# Altium project LOGI-BONE.PrjPcb (part 2 of 2)

## Sheet PERIPHERAL_PORT_IO.SchDoc: Peripheral Port IO
size B; Engineer: M. Jones; Organization: Michael Jones; DocumentNumber: 5; Revision: RA.1; SheetNumber: 5; SheetTotal: 7
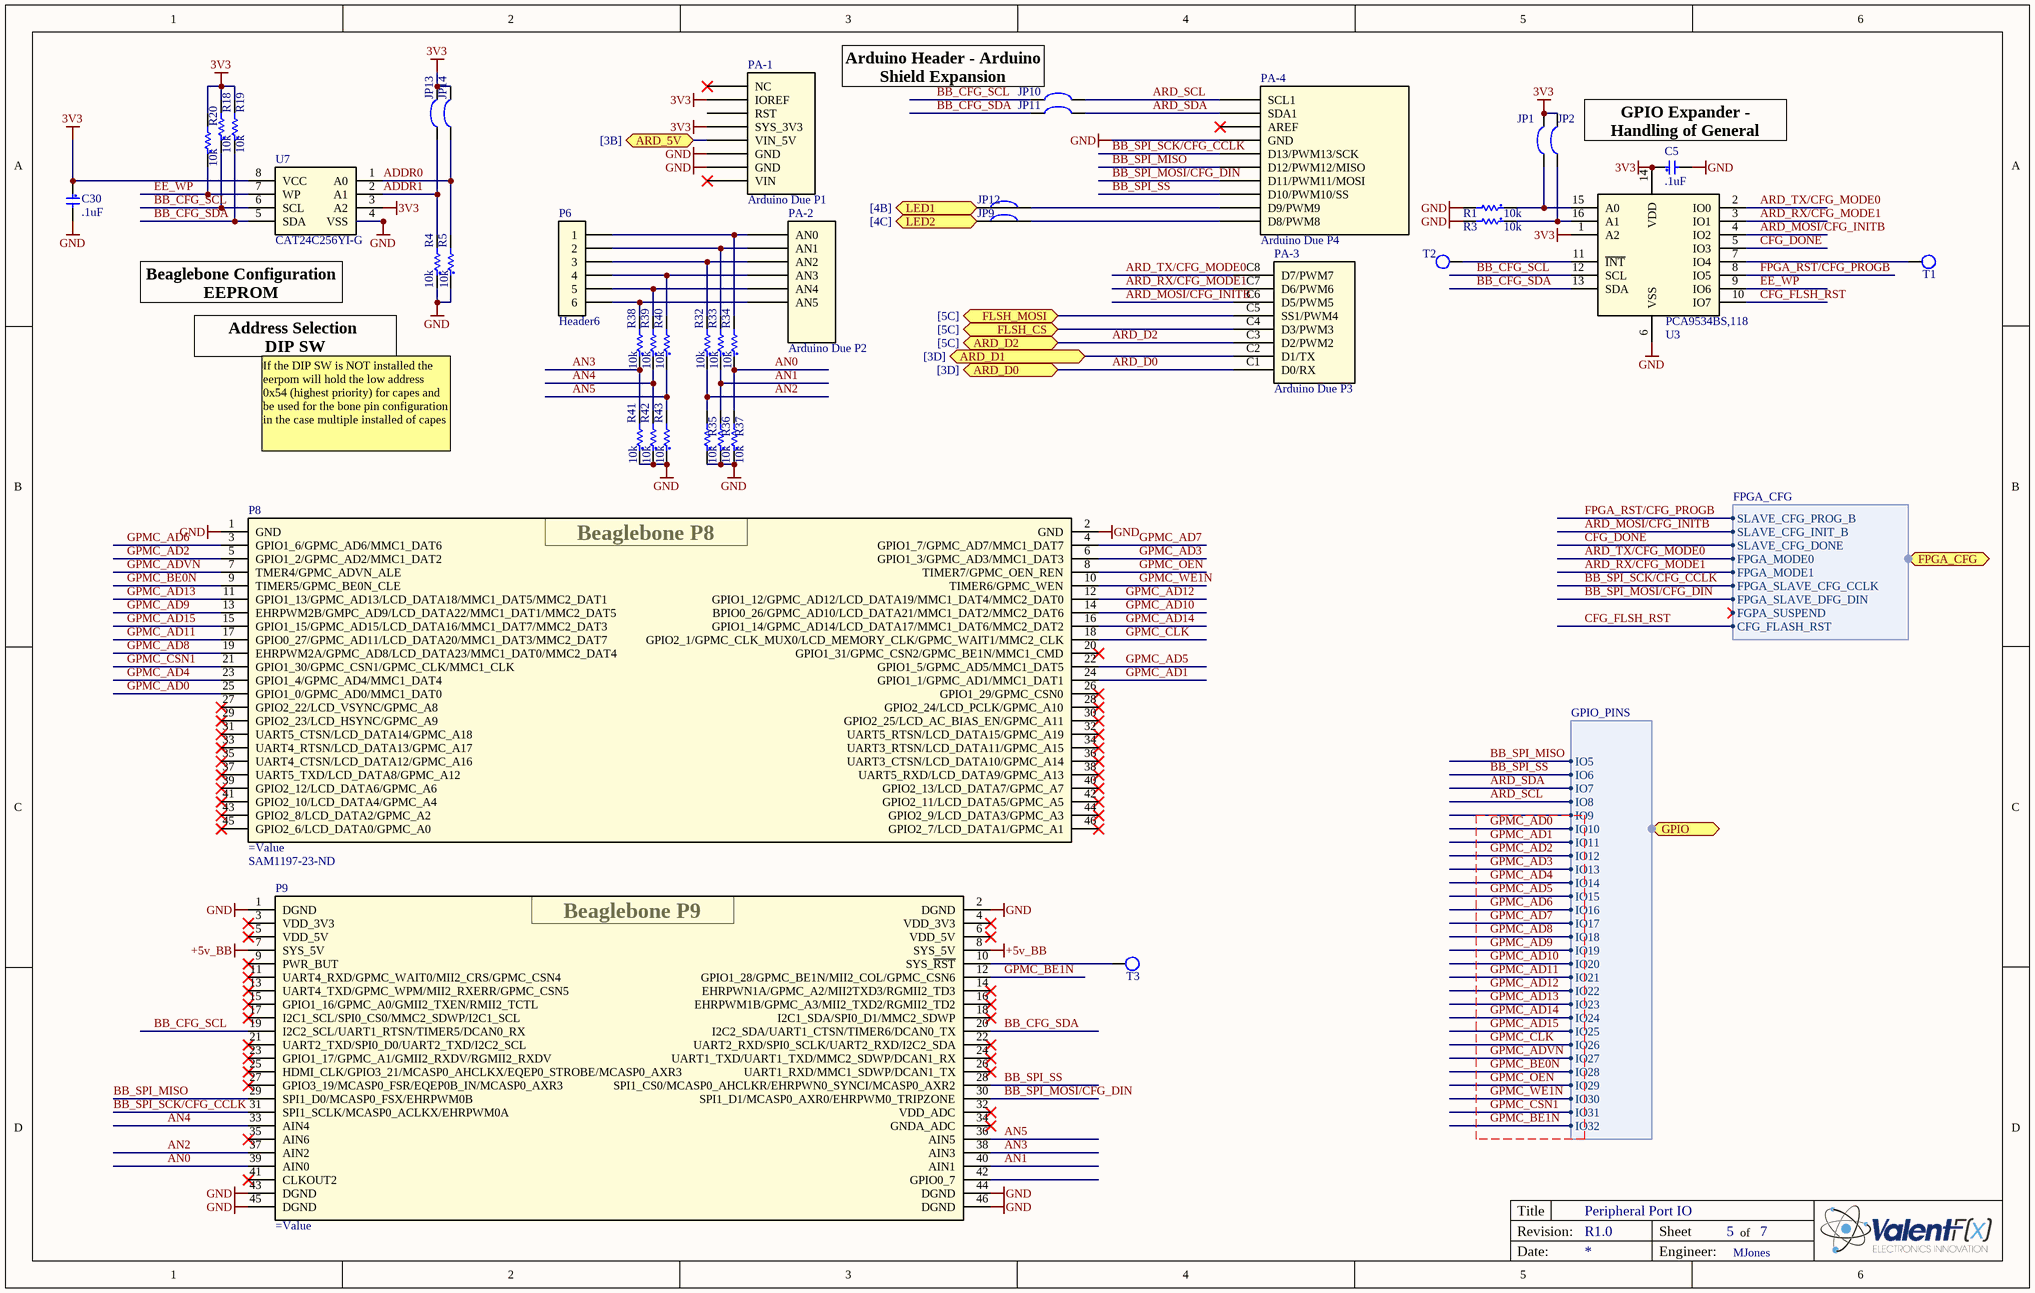
[diagram p4: PERIPHERAL_PORT_IO.SchDoc]

### Parts
C5  .1uF  [c0603]
C30  .1uF  [c0603]
JP1  Solder Jumper  [SOLDER_JUMPER]  (value not drawn)  (net tie, no BOM)
JP2  Solder Jumper  [SOLDER_JUMPER]  (value not drawn)  (net tie, no BOM)
JP9  Solder Jumper-NC  [SOLDER_JUMPER-NC]  (value not drawn)  (net tie, no BOM)
JP10  Solder Jumper  [SOLDER_JUMPER]  (value not drawn)  (net tie, no BOM)
JP11  Solder Jumper  [SOLDER_JUMPER]  (value not drawn)  (net tie, no BOM)
JP12  Solder Jumper-NC  [SOLDER_JUMPER-NC]  (value not drawn)  (net tie, no BOM)
JP13  Solder Jumper  [SOLDER_JUMPER]  (value not drawn)  (net tie, no BOM)
JP14  Solder Jumper  [SOLDER_JUMPER]  (value not drawn)  (net tie, no BOM)
P6  Header6  [HEADER_6_40_100 THRU SIP]  (no BOM)
P8  Supplier Part Number 1: SAM1197-23-ND  [Beaglebone-SSQ]
P9  (no value)  [Beaglebone-SSQ]
PA-1  Arduino Due P1  [Arduino Due P1]
PA-2  Arduino Due P2  [Arduino Due P2]
PA-3  Arduino Due P3  [Arduino Due P3]
PA-4  Arduino Due P4  [Arduino Due P4]
R1  10k  [R0603]
R3  10k  [R0603]
R4  10k  [R0603]
R5  10k  [R0603]
R18  10k  [R0603]
R19  10k  [R0603]
R20  10k  [R0603]
R32  10k  [R0603]
R33  10k  [R0603]
R34  10k  [R0603]
R35  10k  [R0603]
R36  10k  [R0603]
R37  10k  [R0603]
R38  10k  [R0603]
R39  10k  [R0603]
R40  10k  [R0603]
R41  10k  [R0603]
R42  10k  [R0603]
R43  10k  [R0603]
T1  Test Point  [Tp 25-40]  (value not drawn)  (no BOM)
T2  Test Point  [Tp 25-40]  (value not drawn)  (no BOM)
T3  Test Point  [Tp 25-40]  (value not drawn)  (no BOM)
U3  PCA9534BS,118  [EXP - PCA9534BS,118 - QFN65P400X400X100-16M]
U7  CAT24C256YI-G  [TSSOP 8]

### Ports
ARD_5V (see [3B]), ARD_D0 (see [3D]), ARD_D1 (see [3D]), ARD_D2 (see [5C]), FLSH_CS (see [5C]), FLSH_MOSI (see [5C]), FPGA_CFG (harness FPGA_CFG, see [1D]), GPIO (harness GPIO_PINS, see [1A]), LED1 (see [4B]), LED2 (see [4C])

### Harnesses
FPGA_CFG: SLAVE_CFG_PROG_B, SLAVE_CFG_INIT_B, SLAVE_CFG_DONE, FPGA_MODE0, FPGA_MODE1, FPGA_SLAVE_CFG_CCLK, FPGA_SLAVE_DFG_DIN, FGPA_SUSPEND, CFG_FLASH_RST
GPIO_PINS: IO5, IO6, IO7, IO8, IO9, IO10, IO11, IO12, IO13, IO14, IO15, IO16, IO17, IO18, IO19, IO20, IO21, IO22, IO23, IO24, IO25, IO26, IO27, IO28, IO29, IO30, IO31, IO32

### Nets
3V3: C5.1 C30.1 JP1.2 JP2.2 JP13.2 JP14.2 PA-1.A2(IOREF) PA-1.A4(SYS_3V3) R18.2 R19.2 R20.2 U3.1(A2) U3.14(VDD) U7.3(A2) U7.8(VCC)
+5v_BB: P9.7(SYS_5V) P9.8(SYS_5V)
GND: C5.2 C30.2 P8.1(GND) P8.2(GND) P9.1(DGND) P9.2(DGND) P9.43(DGND) P9.44(DGND) P9.45(DGND) P9.46(DGND) PA-1.A6(GND) PA-1.A7(GND) PA-4.D7(GND) R1.2 R3.2 R4.1 R5.1 R35.1 R36.1 R37.1 R41.1 R42.1 R43.1 U3.6(VSS) U7.4(VSS)
ADDR0: JP14.1 R5.2 U7.1(A0)
ADDR1: JP13.1 R4.2 U7.2(A1)
AN0: P9.39(AIN0) R34.1 R37.2
AN1: P9.40(AIN1) R33.1 R36.2
AN2: P9.37(AIN2) R32.1 R35.2
AN3: P9.38(AIN3) R38.1 R41.2
AN4: P9.33(AIN4) R39.1 R42.2
AN5: P9.36(AIN5) R40.1 R43.2
ARD_D0: PA-3.C1(D0/RX) ; port ARD_D0
ARD_D2: PA-3.C3(D2/PWM2) ; port ARD_D2
ARD_MOSI/CFG_INITB: PA-3.C6(D5/PWM5) U3.4(IO2) ; port FPGA_CFG.SLAVE_CFG_INIT_B
ARD_RX/CFG_MODE1: PA-3.C7(D6/PWM6) U3.3(IO1) ; port FPGA_CFG.FPGA_MODE1
ARD_SCL: JP10.2 PA-4.D10(SCL1) ; port GPIO.IO8
ARD_SDA: JP11.2 PA-4.D9(SDA1) ; port GPIO.IO7
ARD_TX/CFG_MODE0: PA-3.C8(D7/PWM7) U3.2(IO0) ; port FPGA_CFG.FPGA_MODE0
BB_CFG_SCL: JP10.1 P9.19(I2C2_SCL/UART1_RTSN/TIMER5/DCAN0_RX) R18.1 U3.12(SCL) U7.6(SCL)
BB_CFG_SDA: JP11.1 P9.20(I2C2_SDA/UART1_CTSN/TIMER6/DCAN0_TX) R19.1 U3.13(SDA) U7.5(SDA)
BB_SPI_MISO: P9.29(SPI1_D0/MCASP0_FSX/EHRPWM0B) PA-4.D5(D12/PWM12/MISO) ; port GPIO.IO5
BB_SPI_MOSI/CFG_DIN: P9.30(SPI1_D1/MCASP0_AXR0/EHRPWM0_TRIPZONE) PA-4.D4(D11/PWM11/MOSI) ; port FPGA_CFG.FPGA_SLAVE_DFG_DIN
BB_SPI_SCK/CFG_CCLK: P9.31(SPI1_SCLK/MCASP0_ACLKX/EHRPWM0A) PA-4.D6(D13/PWM13/SCK) ; port FPGA_CFG.FPGA_SLAVE_CFG_CCLK
BB_SPI_SS: P9.28(SPI1_CS0/MCASP0_AHCLKR/EHRPWN0_SYNCI/MCASP0_AXR2) PA-4.D3(D10/PWM10/SS) ; port GPIO.IO6
CFG_DONE: U3.5(IO3) ; port FPGA_CFG.SLAVE_CFG_DONE
CFG_FLSH_RST: U3.10(IO7) ; port FPGA_CFG.CFG_FLASH_RST
EE_WP: R20.1 U3.9(IO6) U7.7(WP)
FLSH_CS_ARD: PA-3.C4(D3/PWM3) ; port FLSH_CS
FLSH_MOSI_ARD: PA-3.C5(SS1/PWM4) ; port FLSH_MOSI
FPGA_RST/CFG_PROGB: U3.8(IO5) ; port FPGA_CFG.SLAVE_CFG_PROG_B
GPMC_AD0: P8.25(GPIO1_0/GPMC_AD0/MMC1_DAT0) ; port GPIO.IO10
GPMC_AD1: P8.24(GPIO1_1/GPMC_AD1/MMC1_DAT1) ; port GPIO.IO11
GPMC_AD2: P8.5(GPIO1_2/GPMC_AD2/MMC1_DAT2) ; port GPIO.IO12
GPMC_AD3: P8.6(GPIO1_3/GPMC_AD3/MMC1_DAT3) ; port GPIO.IO13
GPMC_AD4: P8.23(GPIO1_4/GPMC_AD4/MMC1_DAT4) ; port GPIO.IO14
GPMC_AD5: P8.22(GPIO1_5/GPMC_AD5/MMC1_DAT5) ; port GPIO.IO15
GPMC_AD6: P8.3(GPIO1_6/GPMC_AD6/MMC1_DAT6) ; port GPIO.IO16
GPMC_AD7: P8.4(GPIO1_7/GPMC_AD7/MMC1_DAT7) ; port GPIO.IO17
GPMC_AD8: P8.19(EHRPWM2A/GPMC_AD8/LCD_DATA23/MMC1_DAT0/MMC2_DAT4) ; port GPIO.IO18
GPMC_AD9: P8.13(EHRPWM2B/GMPC_AD9/LCD_DATA22/MMC1_DAT1/MMC2_DAT5) ; port GPIO.IO19
GPMC_AD10: P8.14(BPIO0_26/GPMC_AD10/LCD_DATA21/MMC1_DAT2/MMC2_DAT6) ; port GPIO.IO20
GPMC_AD11: P8.17(GPIO0_27/GPMC_AD11/LCD_DATA20/MMC1_DAT3/MMC2_DAT7) ; port GPIO.IO21
GPMC_AD12: P8.12(GPIO1_12/GPMC_AD12/LCD_DATA19/MMC1_DAT4/MMC2_DAT0) ; port GPIO.IO22
GPMC_AD13: P8.11(GPIO1_13/GPMC_AD13/LCD_DATA18/MMC1_DAT5/MMC2_DAT1) ; port GPIO.IO23
GPMC_AD14: P8.16(GPIO1_14/GPMC_AD14/LCD_DATA17/MMC1_DAT6/MMC2_DAT2) ; port GPIO.IO24
GPMC_AD15: P8.15(GPIO1_15/GPMC_AD15/LCD_DATA16/MMC1_DAT7/MMC2_DAT3) ; port GPIO.IO25
GPMC_ADVN: P8.7(TMER4/GPMC_ADVN_ALE) ; port GPIO.IO27
GPMC_BE0N: P8.9(TIMER5/GPMC_BE0N_CLE) ; port GPIO.IO28
GPMC_BE1N: P9.12(GPIO1_28/GPMC_BE1N/MII2_COL/GPMC_CSN6) ; port GPIO.IO32
GPMC_CLK: P8.18(GPIO2_1/GPMC_CLK_MUX0/LCD_MEMORY_CLK/GPMC_WAIT1/MMC2_CLK) ; port GPIO.IO26
GPMC_CSN1: P8.21(GPIO1_30/GPMC_CSN1/GPMC_CLK/MMC1_CLK) ; port GPIO.IO31
GPMC_OEN: P8.8(TIMER7/GPMC_OEN_REN) ; port GPIO.IO29
GPMC_WE1N: P8.10(TIMER6/GPMC_WEN) ; port GPIO.IO30
LED0: JP12.1 ; port LED1
LED1: JP9.1 ; port LED2
NetD3_1: PA-1.A5(VIN_5V) ; port ARD_5V
NetJP1_1: JP1.1 R1.1 U3.15(A0)
NetJP2_1: JP2.1 R3.1 U3.16(A1)
NetJP9_2: JP9.2 PA-4.D1(D8/PWM8)
NetJP12_2: JP12.2 PA-4.D2(D9/PWM9)
NetP6_1: P6.1 PA-2.B1(AN0) R34.2
NetP6_2: P6.2 PA-2.B2(AN1) R33.2
NetP6_3: P6.3 PA-2.B3(AN2) R32.2
NetP6_4: P6.4 PA-2.B4(AN3) R40.2
NetP6_5: P6.5 PA-2.B5(AN4) R39.2
NetP6_6: P6.6 PA-2.B6(AN5) R38.2
NetP9_10: P9.10(SYS_~{RST}) T3.1
NetPA-3_C2: PA-3.C2(D1/TX) ; port ARD_D1
NetT1_1: T1.1 U3.7(IO4)
NetT2_1: T2.1 U3.11(~{INT})

Not connected (* = marked no-connect by the designer): P8 20(GPIO1_31/GPMC_CSN2/GPMC_BE1N/MMC1_CMD)* 26(GPIO1_29/GPMC_CSN0)* 27(GPIO2_22/LCD_VSYNC/GPMC_A8)* 28(GPIO2_24/LCD_PCLK/GPMC_A10)* 29(GPIO2_23/LCD_HSYNC/GPMC_A9)* 30(GPIO2_25/LCD_AC_BIAS_EN/GPMC_A11)* 31(UART5_CTSN/LCD_DATA14/GPMC_A18)* 32(UART5_RTSN/LCD_DATA15/GPMC_A19)* 33(UART4_RTSN/LCD_DATA13/GPMC_A17)* 34(UART3_RTSN/LCD_DATA11/GPMC_A15)* 35(UART4_CTSN/LCD_DATA12/GPMC_A16)* 36(UART3_CTSN/LCD_DATA10/GPMC_A14)* 37(UART5_TXD/LCD_DATA8/GPMC_A12)* 38(UART5_RXD/LCD_DATA9/GPMC_A13)* 39(GPIO2_12/LCD_DATA6/GPMC_A6)* 40(GPIO2_13/LCD_DATA7/GPMC_A7)* 41(GPIO2_10/LCD_DATA4/GPMC_A4)* 42(GPIO2_11/LCD_DATA5/GPMC_A5)* 43(GPIO2_8/LCD_DATA2/GPMC_A2)* 44(GPIO2_9/LCD_DATA3/GPMC_A3)* 45(GPIO2_6/LCD_DATA0/GPMC_A0)* 46(GPIO2_7/LCD_DATA1/GPMC_A1)*; P9 3(VDD_3V3)* 4(VDD_3V3)* 5(VDD_5V)* 6(VDD_5V)* 9(PWR_BUT)* 11(UART4_RXD/GPMC_WAIT0/MII2_CRS/GPMC_CSN4)* 13(UART4_TXD/GPMC_WPM/MII2_RXERR/GPMC_CSN5)* 14(EHRPWN1A/GPMC_A2/MII2TXD3/RGMII2_TD3)* 15(GPIO1_16/GPMC_A0/GMII2_TXEN/RMII2_TCTL)* 16(EHRPWM1B/GPMC_A3/MII2_TXD2/RGMII2_TD2)* 17(I2C1_SCL/SPI0_CS0/MMC2_SDWP/I2C1_SCL)* 18(I2C1_SDA/SPI0_D1/MMC2_SDWP)* 21(UART2_TXD/SPI0_D0/UART2_TXD/I2C2_SCL)* 22(UART2_RXD/SPI0_SCLK/UART2_RXD/I2C2_SDA)* 23(GPIO1_17/GPMC_A1/GMII2_RXDV/RGMII2_RXDV)* 24(UART1_TXD/UART1_TXD/MMC2_SDWP/DCAN1_RX)* 25(HDMI_CLK/GPIO3_21/MCASP0_AHCLKX/EQEP0_STROBE/MCASP0_AXR3)* 26(UART1_RXD/MMC1_SDWP/DCAN1_TX)* 27(GPIO3_19/MCASP0_FSR/EQEP0B_IN/MCASP0_AXR3)* 32(VDD_ADC)* 34(GNDA_ADC)* 35(AIN6)* 41(CLKOUT2)* 42(GPIO0_7); PA-1 A1(NC)* A3(RST) A8(VIN)*; PA-4 D8(AREF)*

### Notes on the sheet
- (near JP10) Arduino Header - Arduino Shield Expansion
- GPIO Expander - Handling of General Control Pins
- (near U7) Beaglebone Configuration EEPROM
- Address Selection
  DIP SW
- If the DIP SW is NOT installed the eerpom will hold the low address 0x54 (highest priority) for capes and be used for the bone pin configuration in the case multiple installed of capes
- (near P8) Beaglebone P8
- (near P9) Beaglebone P9
- Title
- Revision:
- Sheet
- of
- Date:
- Engineer:

### Library data of the parts
C5 C30 = C0603 - CL10F104ZA8NNNC: CAP CER 0.1UF 25V Y5V 0603; Manufacturer: Samsung Electro-Mechanics America, Inc; Capacitance: 0.1µF; Tolerance: -20%, +80%; Temperature Coefficient: Y5V (F); Accept Alternative: Yes; Value: .1uF; Supplier 1: Digi-Key; Supplier Part Number 1: 1276-1011-1-ND; Manufacturer Part Number: CL10F104ZA8NNNC; RoHS: RoHS Compliant; Category: Capacitors; Stock 1: 400907; Pricing 1: 1=0.1, 10=0.017, 25=0.012, 50=0.009, 100=0.0076, 250=0.00624, 500=0.00536, 1000=0.00417 (USD); Package / Case: 0603 (1608 Metric); Packaging: Cut Tape (CT); ComponentLink1URL: http://www.samsungsem.com/servlet/FileDownload?type=spec&file=CL10F104ZA8NNNC.pdf; ComponentLink1Description: http://www.samsungsem.com/servlet/FileDownload?type=spec&file=CL10F104ZA8NNNC.pdf; Voltage - Rated: 25V; Mounting Type: Surface Mount, MLCC; Operating Temperature: -30°C ~ 85°C; Applications: General Purpose; Ratings: -; Size / Dimension: 0.063" L x 0.031" W (1.60mm x 0.80mm); Height - Seated (Max): -; Thickness (Max): 0.035" (0.90mm); Lead Spacing: -; Features: -; Lead Style: -; Accept Compatible Replacement Part: Yes
JP1 JP2 JP10 JP11 JP13 JP14 = Solder Jumper: Solder/Configuration Jumper; Manufacturer: n/a; Manufacturer Part Number: n/a; Source: n/a; Source Part Number: n/a; ROHS Certificate: n/a
JP9 JP12 = Solder Jumper-NC: Solder/Configuration Jumper; Manufacturer: n/a; Manufacturer Part Number: n/a; Source: n/a; Source Part Number: n/a; ROHS Certificate: n/a
P6 = Header6: Header 6 pin
P8 = Beagle_Bone_Black_P8-SSQ: Beagle_Bone_Black_P8; Manufacturer: Samtec Inc; Manufacturer Part Number: SSQ-123-03-G-D-RA; Connector Type: Receptacle; Number of Positions: 46; Number of Positions Loaded: All; Pitch: 0.100" (2.54mm); Supplier 1: Digi-Key; RoHS: RoHS Compliant; Category: Connectors, Interconnects; Stock 1: 0; Pricing 1: 1=0 (USD); Packaging: Bulk; Contact Type: Female Socket; Number of Rows: 2; Row Spacing: 0.100" (2.54mm); Mounting Type: Through Hole, Right Angle; Termination: Solder; Fastening Type: -; Features: -; Contact Finish: Gold; Contact Finish Thickness: 20µin (0.51µm); Color: Black; ComponentLink1URL: http://www.samtec.com/documents/webfiles/cpdf/SSQ-1XX-XX-XXX-X-XX-XXX-XX-X-MKT.pdf; ComponentLink1Description: http://www.samtec.com/documents/webfiles/cpdf/SSQ-1XX-XX-XXX-X-XX-XXX-XX-X-MKT.pdf
P9 = Beagle_Bone_Black_P9-SSQ: Beagle_Bone_Black_P9; Manufacturer: Samtec Inc; Manufacturer Part Number: SSQ-123-03-G-D-RA; Connector Type: Receptacle; Number of Positions: 46; Number of Positions Loaded: All; Pitch: 0.100" (2.54mm); Supplier 1: Digi-Key; RoHS: RoHS Compliant; Category: Connectors, Interconnects; Stock 1: 0; Pricing 1: 1=0 (USD); Packaging: Bulk; Contact Type: Female Socket; Number of Rows: 2; Row Spacing: 0.100" (2.54mm); Mounting Type: Through Hole, Right Angle; Termination: Solder; Fastening Type: -; Features: -; Contact Finish: Gold; Contact Finish Thickness: 20µin (0.51µm); Color: Black; ComponentLink1URL: http://www.samtec.com/documents/webfiles/cpdf/SSQ-1XX-XX-XXX-X-XX-XXX-XX-X-MKT.pdf; ComponentLink1Description: http://www.samtec.com/documents/webfiles/cpdf/SSQ-1XX-XX-XXX-X-XX-XXX-XX-X-MKT.pdf; Supplier Part Number 1: SAM1197-23-ND
PA-1 = Arduino Due P1: CONN HEADER FEMALE 8POS .1" GOLD; Manufacturer: Sullins Connector Solutions; Manufacturer Part Number: PPPC081LFBN-RC; Number of Positions: 8; Number of Positions Loaded: All; Pitch: 0.100" (2.54mm); Supplier 1: Digi-Key; RoHS: RoHS Compliant; Category: Connectors, Interconnects; Stock 1: 30245; Pricing 1: 1=0.89, 10=0.69, 25=0.6436, 50=0.585, 100=0.5265, 250=0.4446, 500=0.4212, 1000=0.3744, 2500=0.31122 (USD); Packaging: Bulk; Connector Type: Header; Contact Type: Female Socket; Number of Rows: 1; Row Spacing: -; Mounting Type: Through Hole; Termination: Solder; Fastening Type: -; Features: -; Contact Finish: Gold; Contact Finish Thickness: Flash; Color: Black; ComponentLink1URL: http://www.sullinscorp.com/drawings/78_P(N)PxCxxxLFBN-RC,_10492-G.pdf; ComponentLink1Description: http://www.sullinscorp.com/drawings/78_P(N)PxCxxxLFBN-RC,_10492-G.pdf; Supplier Part Number 1: S7041-ND
PA-2 = Arduino Due P2: CONN HEADER FEMALE 6POS .1" GOLD; Manufacturer: Sullins Connector Solutions; Manufacturer Part Number: PPPC061LFBN-RC; Number of Positions: 6; Number of Positions Loaded: All; Pitch: 0.100" (2.54mm); Supplier 1: Digi-Key; RoHS: RoHS Compliant; Category: Connectors, Interconnects; Stock 1: 9213; Pricing 1: 1=0.7, 10=0.546, 25=0.5088, 50=0.4626, 100=0.4163, 250=0.35152, 500=0.333, 1000=0.296, 2500=0.24605 (USD); Packaging: Bulk; Connector Type: Header; Contact Type: Female Socket; Number of Rows: 1; Row Spacing: -; Mounting Type: Through Hole; Termination: Solder; Fastening Type: -; Features: -; Contact Finish: Gold; Contact Finish Thickness: Flash; Color: Black; ComponentLink1URL: http://www.sullinscorp.com/drawings/78_P(N)PxCxxxLFBN-RC,_10492-G.pdf; ComponentLink1Description: http://www.sullinscorp.com/drawings/78_P(N)PxCxxxLFBN-RC,_10492-G.pdf; Supplier Part Number 1: S7039-ND
PA-3 = Arduino Due P3: CONN HEADER FEMALE 8POS .1" GOLD; Manufacturer: Sullins Connector Solutions; Manufacturer Part Number: PPPC081LFBN-RC; Number of Positions: 8; Number of Positions Loaded: All; Pitch: 0.100" (2.54mm); Supplier 1: Digi-Key; RoHS: RoHS Compliant; Category: Connectors, Interconnects; Stock 1: 30245; Pricing 1: 1=0.89, 10=0.69, 25=0.6436, 50=0.585, 100=0.5265, 250=0.4446, 500=0.4212, 1000=0.3744, 2500=0.31122 (USD); Packaging: Bulk; Connector Type: Header; Contact Type: Female Socket; Number of Rows: 1; Row Spacing: -; Mounting Type: Through Hole; Termination: Solder; Fastening Type: -; Features: -; Contact Finish: Gold; Contact Finish Thickness: Flash; Color: Black; ComponentLink1URL: http://www.sullinscorp.com/drawings/78_P(N)PxCxxxLFBN-RC,_10492-G.pdf; ComponentLink1Description: http://www.sullinscorp.com/drawings/78_P(N)PxCxxxLFBN-RC,_10492-G.pdf; Supplier Part Number 1: S7041-ND
PA-4 = Arduino Due P4: CONN HEADER FMALE 10POS .1" GOLD; Manufacturer: Sullins Connector Solutions; Manufacturer Part Number: PPPC101LFBN-RC; Number of Positions: 10; Number of Positions Loaded: All; Pitch: 0.100" (2.54mm); Supplier 1: Digi-Key; RoHS: RoHS Compliant; Category: Connectors, Interconnects; Stock 1: 5570; Pricing 1: 1=0.84, 10=0.699, 25=0.6476, 50=0.5828, 100=0.518, 250=0.45324, 500=0.4144, 1000=0.37555, 2500=0.3367 (USD); Packaging: Bulk; Connector Type: Header; Contact Type: Female Socket; Number of Rows: 1; Row Spacing: -; Mounting Type: Through Hole; Termination: Solder; Fastening Type: -; Features: -; Contact Finish: Gold; Contact Finish Thickness: Flash; Color: Black; ComponentLink1URL: http://www.sullinscorp.com/drawings/78_P(N)PxCxxxLFBN-RC,_10492-G.pdf; ComponentLink1Description: http://www.sullinscorp.com/drawings/78_P(N)PxCxxxLFBN-RC,_10492-G.pdf; Supplier Part Number 1: S7043-ND
R1 R3-R5 R18-R20 R32-R43 = R0603 - CRCW060310K0FKEA: 10k Thick Film Resistors - SMD 1/10watt 10Kohms 1%; Manufacturer: Vishay Dale; Power (Watts): 0.1W, 1/10W; Temperature Coefficient: ±100ppm/°C; Manufacturer Part Number: CRCW060310K0FKEA; Value: 10k; Supplier 1: Digi-Key; RoHS: RoHS Compliant; Category: Resistors; Stock 1: 997856; Pricing 1: 10=0.081, 50=0.0436, 200=0.0251, 1000=0.01711 (USD); Resistance (Ohms): 10K; Composition: Thick Film; Features: -; Tolerance: ±1%; Size / Dimension: 0.061" L x 0.033" W (1.55mm x 0.85mm); Height: 0.020" (0.50mm); Packaging: Cut Tape (CT); Package / Case: 0603 (1608 Metric); ComponentLink1URL: http://www.vishay.com/doc?20035; ComponentLink1Description: http://www.vishay.com/doc?20035; Supplier Part Number 1: 541-10.0KHCT-ND; Number of Terminations: 2
T1-T3 = Test Point 2: Test Point Smaller Symbol
U3 = EXP - PCA9534BS,118: I/O Expanders, Repeaters & Hubs 8BIT I2C/SMBUS I/O; Manufacturer: NXP Semiconductors; Output Current: 50 mA; Logic Family: PCA; Power Dissipation: 200 mW; Operating Supply Voltage: 2.3 V to 5.5 V; Supplier 1: Mouser; Manufacturer Part Number: PCA9534BS,118; RoHS: RoHS Compliant; Category: I/O Expanders, Repeaters & Hubs; Stock 1: 6089; Pricing 1: 1=1.27, 25=1.16, 100=1.09, 250=1.04, 500=1.00, 1000=0.960, 3000=0.933, 6000=0.899, 12000=0.875 (AUD); Operating Temperature Range: - 40 C to + 85 C; Package / Case: HVQFN-16; Packaging: Reel; Mounting Style: SMD/SMT; Product Category: I/O Expanders; Standard Pack Qty: 6000; RoHS - Mouser: Y; Minimum Order Quantity: 1; Reeling: True; ComponentLink1URL: http://www.nxp.com/documents/data_sheet/PCA9534.pdf; ComponentLink1Description: http://www.nxp.com/documents/data_sheet/PCA9534.pdf; Supplier Part Number 1: 771-PCA9534BS118; Value: PCA9534BS,118
U7 = EEPROM - CAT24C256YI-G: IC EEPROM 256KBIT 400KHZ 8TSSOP; Manufacturer: ON Semiconductor; Format - Memory: EEPROMs - Serial; Memory Size: 256K (32K x 8); Interface: I²C, 2-Wire Serial; Voltage - Supply: 1.8 V ~ 5.5 V; Supplier 1: Digi-Key; Manufacturer Part Number: CAT24C256YI-G; RoHS: RoHS Compliant; Category: Integrated Circuits (ICs); Stock 1: 840; Pricing 1: 1=0.97, 10=0.845, 25=0.7488, 100=0.6521, 250=0.56752, 500=0.483, 1000=0.3864, 2500=0.35018, 5000=0.32603 (USD); Memory Type: EEPROM; Speed: 400kHz; Operating Temperature: -40°C ~ 85°C; Package / Case: 8-TSSOP (0.173", 4.40mm Width); Supplier Device Package: 8-TSSOP; Packaging: Tube; ComponentLink1URL: http://www.onsemi.com/pub_link/Collateral/CAT24C256-D.PDF; ComponentLink1Description: http://www.onsemi.com/pub_link/Collateral/CAT24C256-D.PDF; Supplier Part Number 1: CAT24C256YI-GOS-ND; Value: CAT24C256YI-G

## Sheet POWER_SUPPLY.SchDoc: Power Supply
size B; Engineer: M. Jones; Organization: Michael Jones; DocumentNumber: 2; Revision: RA.1; SheetNumber: 2; SheetTotal: 7
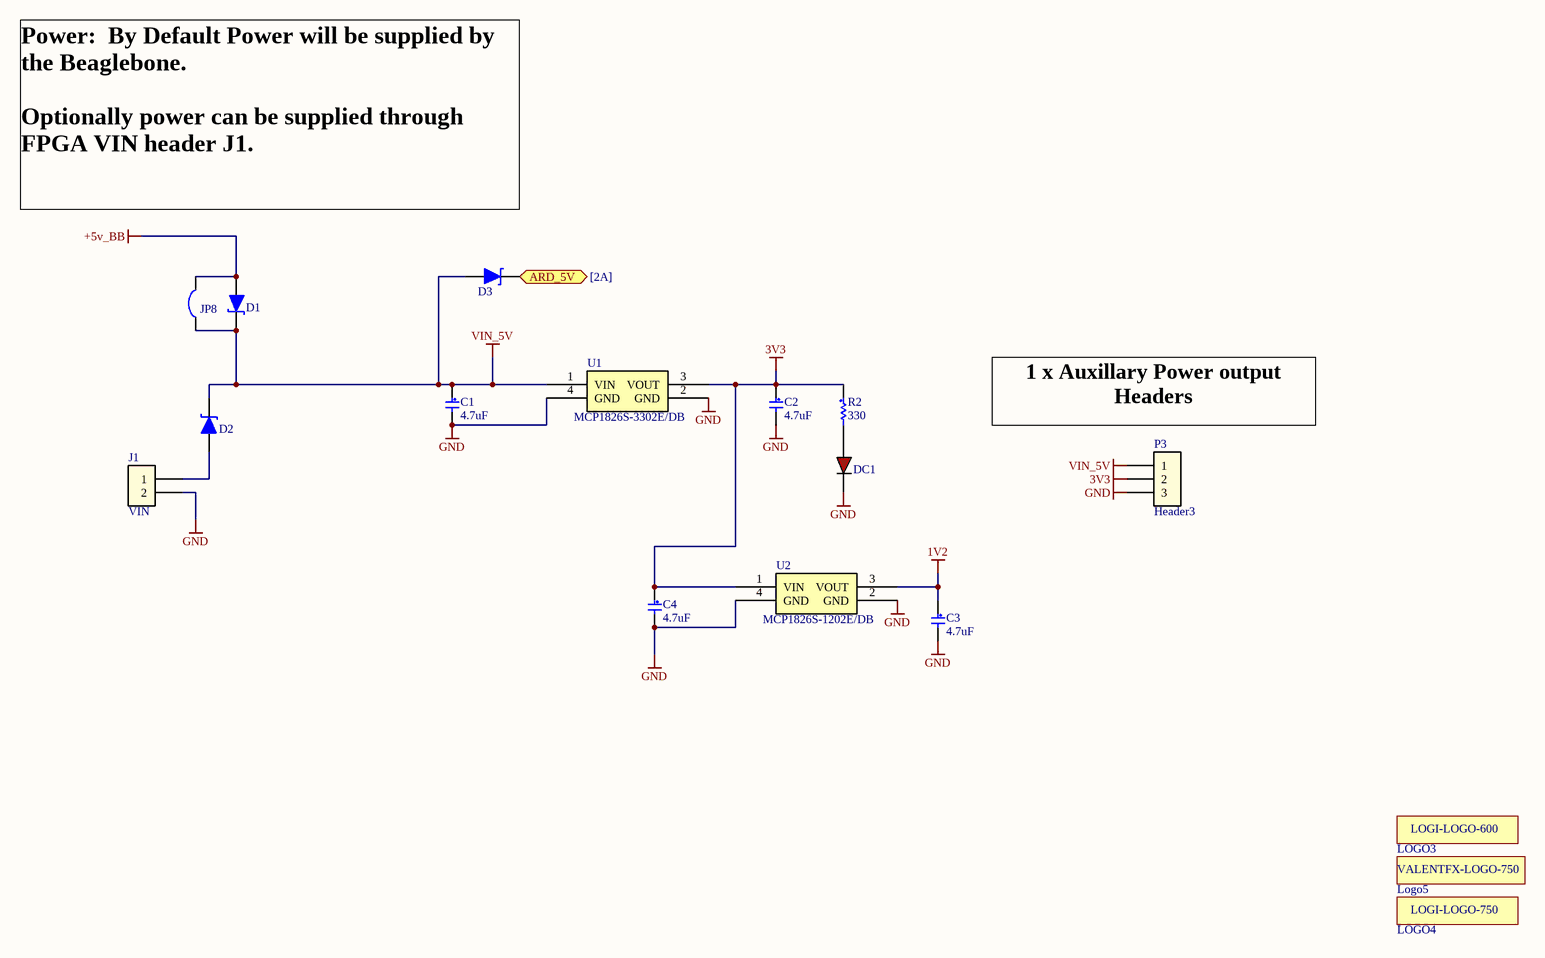
[diagram p5: POWER_SUPPLY.SchDoc]

### Parts
C1  4.7uF  [C0603 - Marked]
C2  4.7uF  [C0603 - Marked]
C3  4.7uF  [C0603 - Marked]
C4  4.7uF  [C0603 - Marked]
D1  RB161M-20TR  [SOD-123]  (value not drawn)
D2  RB161M-20TR  [SOD-123]  (value not drawn)
D3  RB161M-20TR  [SOD-123]  (value not drawn)
DC1  598-8010-107F  [LED_0603 - RED]  (value not drawn)
J1  VIN  [HEADER_2_40_100 THRU SIP]  (no BOM)
JP8  Solder Jumper  [SOLDER_JUMPER]  (value not drawn)  (no BOM)
LOGO3  LOGI-600  [LOGI-600-SILK]  (value not drawn)  (no BOM)
LOGO4  LOGI-750  [LOGI-750-SILK-NB]  (value not drawn)  (no BOM)
Logo5  Valent Logo 750  [VALENTFX_750-SolderMask]  (value not drawn)  (no BOM)
P3  Header3  [HEADER_3_40_100 THRU SIP]  (no BOM)
R2  330  [R0603]
U1  MCP1826S-3302E/DB  [SOT223]
U2  MCP1826S-1202E/DB  [SOT223]

### Ports
ARD_5V (see [2A])

### Nets
1V2: C3.1 U2.3(VOUT)
3V3: C2.1 C4.1 P3.2 R2.1 U1.3(VOUT) U2.1(VIN)
+5v_BB: D1.2(A) JP8.1
GND: C1.2 C2.2 C3.2 C4.2 DC1.C J1.2 P3.3 U1.2(GND) U1.4(GND) U2.2(GND) U2.4(GND)
VIN_5V: C1.1 D1.1(C) D2.1(C) D3.2(A) JP8.2 P3.1 U1.1(VIN)
NetD2_2: D2.2(A) J1.1
NetD3_1: D3.1(C) ; port ARD_5V
NetDC1_A: DC1.A R2.2

### Notes on the sheet
- Power:  By Default Power will be supplied by the Beaglebone.
  Optionally power can be supplied through FPGA VIN header J1.
- (near P3) 1 x Auxillary Power output Headers
- Title
- Revision:
- Sheet
- of
- Date:
- Engineer:
- (in symbol LOGI-600) LOGI-LOGO-600
- (in symbol LOGI-750) LOGI-LOGO-750
- (in symbol Valent Logo 750) VALENTFX-LOGO-750

### Library data of the parts
C1-C4 = C0603 - GRM188R60J475KE19D: 4.7uF 6.3volts X5R 10% (MLCC) - SMD/SMT 0603; Manufacturer: Murata Electronics North America; Accept Compatible Replacement Part: Yes; Capacitance: 4.7µF; Voltage - Rated: 6.3V; Value: 4.7uF; Supplier 1: Digi-Key; Supplier Part Number 1: 490-3297-1-ND; Manufacturer Part Number: GRM188R60J475KE19D; RoHS: RoHS Compliant; Category: Capacitors; Stock 1: 614848; Pricing 1: 1=0.19, 10=0.132, 50=0.076, 100=0.0627, 250=0.05284, 500=0.04426, 1000=0.03633 (USD); Tolerance: ±10%; Package / Case: 0603 (1608 Metric); Packaging: Cut Tape (CT); ComponentLink1URL: http://search.murata.co.jp/Ceramy/image/img/PDF/ENG/GRM188R60J475KE19.pdf; ComponentLink1Description: http://search.murata.co.jp/Ceramy/image/img/PDF/ENG/GRM188R60J475KE19.pdf; Temperature Coefficient: X5R; Mounting Type: Surface Mount, MLCC; Operating Temperature: -55°C ~ 85°C; Applications: General Purpose; Ratings: -; Size / Dimension: 0.063" L x 0.031" W (1.60mm x 0.80mm); Height - Seated (Max): -; Thickness (Max): 0.035" (0.90mm); Lead Spacing: -; Features: -; Lead Style: -
D1-D3 = RB161M-20TR: DIODE SCHOTTKY 25V 1A SOD123; Source Part Number: RB161M-20CT-ND; Manufacturer: Diodes Inc; Manufacturer Part Number: Rohm Semiconductor; Voltage - Forward (Vf) (Max) @ If: 350mV @ 1A; Voltage - DC Reverse (Vr) (Max): 20V; Current - Reverse Leakage @ Vr: 700µA @ 20V; Speed: Fast Recovery =< 500ns, > 200mA (Io); Source: Digikey; Value: RB161M-20TR; Supplier 1: Digi-Key; RoHS: RoHS Compliant; Category: Discrete Semiconductor Products; Stock 1: 29589; Pricing 1: 1=0.58, 25=0.4044, 100=0.3465, 250=0.29924, 500=0.25726, 1000=0.1995 (USD); Current - Average Rectified (Io): 1A; Diode Type: Schottky; Reverse Recovery Time (trr): -; Capacitance @ Vr, F: -; Mounting Type: Surface Mount; Package / Case: SOD-123F; Supplier Device Package: PMDU; Packaging: Cut Tape (CT); ComponentLink1URL: http://www.rohm.com/products/databook/di/pdf/rb161m-20.pdf; ComponentLink1Description: http://www.rohm.com/products/databook/di/pdf/rb161m-20.pdf; Supplier Part Number 1: RB161M-20CT-ND
DC1 = LED0603 - 598-8010-107F: LED ALINGAP RED CLEAR 0603 SMD; Manufacturer: Dialight; Current - Test: 20mA; Wavelength - Dominant: 635nm; Millicandela Rating: 40mcd; Voltage - Forward (Vf) Typ: 2.2V; Lens Style/Size: Rectangle with Flat Top, 1.1mm x 0.8mm; Viewing Angle: 140°; Accept Replacement: YES - Water Clear; Supplier 1: Digi-Key; Manufacturer Part Number: 598-8010-107F; RoHS: RoHS Compliant; Category: Optoelectronics; Stock 1: 37578; Pricing 1: 1=0.45, 10=0.33, 25=0.264, 100=0.1749, 250=0.1452, 500=0.1056, 1000=0.0825 (USD); Color: Red; Luminous Flux @ Current - Test: -; Wavelength - Peak: -; Lens Type: Clear; Size / Dimension: 1.60mm L x 0.80mm W; Height: 0.70mm; Package / Case: 0603 (1608 Metric); Mounting Type: Surface Mount; Packaging: Digi-Reel®; ComponentLink1URL: http://media.digikey.com/pdf/Data%20Sheets/Dialight%20PDFs/598_Series_0603_Pkg.pdf; ComponentLink1Description: http://media.digikey.com/pdf/Data%20Sheets/Dialight%20PDFs/598_Series_0603_Pkg.pdf; Supplier Part Number 1: 350-2029-6-ND
J1 = Header2: Header 2 pin
JP8 = Solder Jumper: Solder/Configuration Jumper; Manufacturer: n/a; Manufacturer Part Number: n/a; Source: n/a; Source Part Number: n/a; ROHS Certificate: n/a
P3 = Header3: Header  pin
R2 = R0603 - ERJ-3GEYJ331V: Thick Film Resistors - SMD 0603 330ohms 5% Tol; Manufacturer: Panasonic; Temperature Coefficient: 200 PPM / C; Power Rating: 100 mW; Voltage Rating: 75 V; Manufacturer Part Number: ERJ-3GEYJ331V; Value: 330; Supplier 1: Mouser; Supplier Part Number 1: 667-ERJ-3GEYJ331V; RoHS: RoHS Compliant By Exemption; Category: Thick Film Resistors - SMD; Stock 1: 131470; Pricing 1: 1=0.108, 10=0.012, 100=0.005, 1000=0.004, 5000=0.003 (AUD); Tolerance: 5 %; Packaging: Reel; Package / Case: 0603 (1608 metric); ComponentLink1URL: http://www.mouser.com/ds/2/315/AOA0000CE1-37422.pdf; ComponentLink1Description: http://www.mouser.com/ds/2/315/AOA0000CE1-37422.pdf; Dimensions: 0.8 mm W x 1.6 mm L x 0.45 mm H; Operating Temperature Range: - 55 C to + 155 C; Product: Thick Film Resistors SMD; Resistance: 330 Ohms; Series: ERJ; Termination Style: SMD/SMT; Case Code - in: 0603; Case Code - mm: 1608; Standard Pack Qty: 5000; RoHS - Mouser: E; Minimum Order Quantity: 1; Reeling: True
U1 = REG - MCP1826S-3302E/DB: LDO REG 1A 3.3V SOT223-3; Manufacturer: Microchip Technology; Regulator Topology: Positive Fixed; Voltage - Input: Up to 6V; Voltage - Dropout (Typical): 0.25V @ 1A; Number of Regulators: 1; Current - Output: 1A (Min); Value: MCP1826S-3302E/DB; Supplier 1: Digi-Key; Supplier Part Number 1: MCP1826S-3302E/DB-ND; Manufacturer Part Number: MCP1826S-3302E/DB; RoHS: RoHS Compliant; Category: Integrated Circuits (ICs); Stock 1: 2041; Pricing 1: 1=0.74, 10=0.68, 25=0.57, 100=0.52 (USD); Voltage - Output: 3.3V; Current - Limit (Min): -; Operating Temperature: -40°C ~ 125°C; Mounting Type: Surface Mount; Package / Case: TO-261-4, TO-261AA; Supplier Device Package: SOT-223-3; Packaging: Tube; ComponentLink1URL: http://ww1.microchip.com/downloads/en/DeviceDoc/22057a.pdf; ComponentLink1Description: http://ww1.microchip.com/downloads/en/DeviceDoc/22057a.pdf
U2 = MCP1826S-1202E/DB: IC LDO REG 1A 1.2V SOT223-3; Manufacturer: Microchip Technology; Regulator Topology: Positive Fixed; Voltage - Input: Up to 6V; Voltage - Dropout (Typical): 0.25V @ 1A; Number of Regulators: 1; Current - Output: 1A (Min); Value: MCP1826S-1202E/DB; Supplier 1: Digi-Key; Supplier Part Number 1: MCP1826S-1202E/DB-ND; Manufacturer Part Number: MCP1826S-1202E/DB; RoHS: RoHS Compliant; Category: Integrated Circuits (ICs); Stock 1: 2041; Pricing 1: 1=0.74, 10=0.68, 25=0.57, 100=0.52 (USD); Voltage - Output: 1.2V; Current - Limit (Min): -; Operating Temperature: -40°C ~ 125°C; Mounting Type: Surface Mount; Package / Case: TO-261-4, TO-261AA; Supplier Device Package: SOT-223-3; Packaging: Tube; ComponentLink1URL: http://ww1.microchip.com/downloads/en/DeviceDoc/22057a.pdf; ComponentLink1Description: http://ww1.microchip.com/downloads/en/DeviceDoc/22057a.pdf

## Sheet RAM.SchDoc: RAM
size B; Engineer: MJones; Organization: Michael Jones; DocumentNumber: 7; SheetNumber: 7; SheetTotal: 7
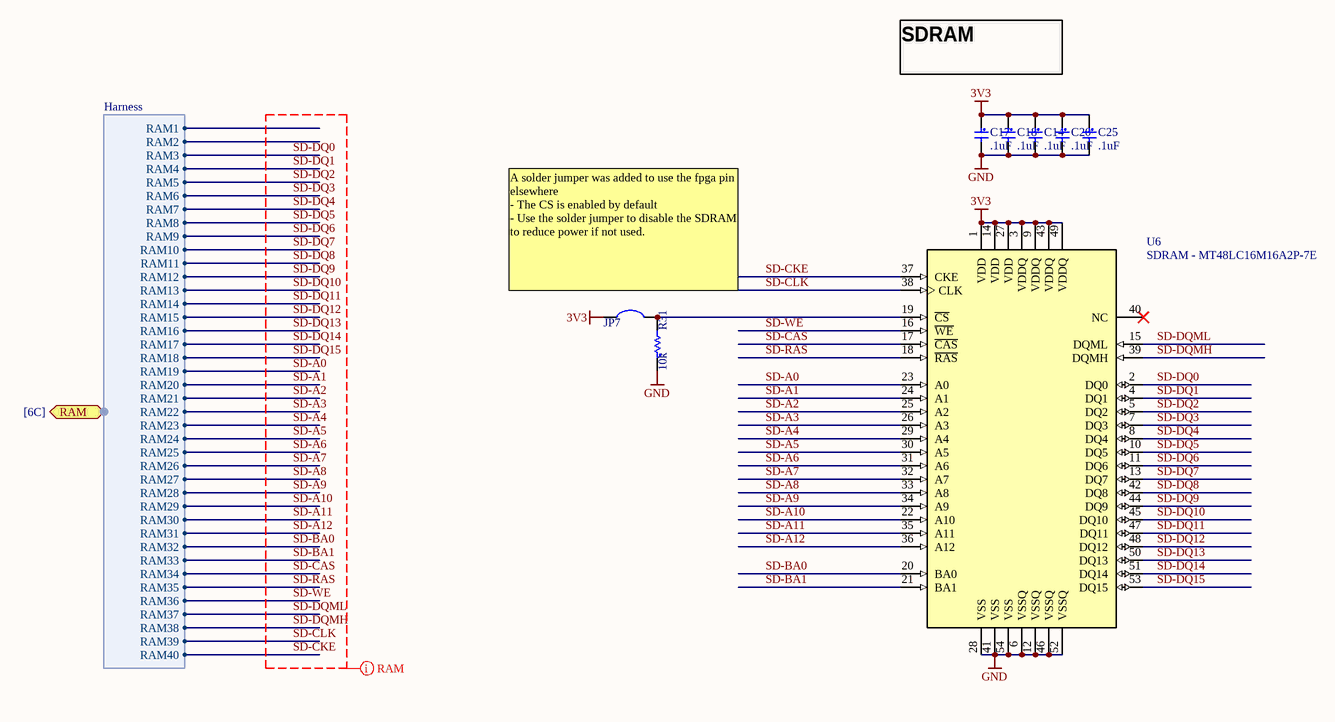
[diagram p6: RAM.SchDoc]

### Parts
C14  .1uF  [c0603]
C17  .1uF  [c0603]
C18  .1uF  [c0603]
C20  .1uF  [c0603]
C25  .1uF  [c0603]
JP7  Solder Jumper  [SOLDER_JUMPER]  (value not drawn)  (no BOM)
R31  10k  [R0603]
U6  SDRAM - MT48LC16M16A2P-7E  [TSOP2-54_L]

### Ports
RAM (harness Harness, see [6C])

### Harnesses
Harness: RAM1, RAM2, RAM3, RAM4, RAM5, RAM6, RAM7, RAM8, RAM9, RAM10, RAM11, RAM12, RAM13, RAM14, RAM15, RAM16, RAM17, RAM18, RAM19, RAM20, RAM21, RAM22, RAM23, RAM24, RAM25, RAM26, RAM27, RAM28, RAM29, RAM30, RAM31, RAM32, RAM33, RAM34, RAM35, RAM36, RAM37, RAM38, RAM39, RAM40

### Nets
3V3: C14.1 C17.1 C18.1 C20.1 C25.1 JP7.1 U6.1(VDD) U6.3(VDDQ) U6.9(VDDQ) U6.14(VDD) U6.27(VDD) U6.43(VDDQ) U6.49(VDDQ)
GND: C14.2 C17.2 C18.2 C20.2 C25.2 R31.1 U6.6(VSSQ) U6.12(VSSQ) U6.28(VSS) U6.41(VSS) U6.46(VSSQ) U6.52(VSSQ) U6.54(VSS)
SD-A0: U6.23(A0) ; port RAM.RAM19
SD-A1: U6.24(A1) ; port RAM.RAM20
SD-A2: U6.25(A2) ; port RAM.RAM21
SD-A3: U6.26(A3) ; port RAM.RAM22
SD-A4: U6.29(A4) ; port RAM.RAM23
SD-A5: U6.30(A5) ; port RAM.RAM24
SD-A6: U6.31(A6) ; port RAM.RAM25
SD-A7: U6.32(A7) ; port RAM.RAM26
SD-A8: U6.33(A8) ; port RAM.RAM27
SD-A9: U6.34(A9) ; port RAM.RAM28
SD-A10: U6.22(A10) ; port RAM.RAM29
SD-A11: U6.35(A11) ; port RAM.RAM30
SD-A12: U6.36(A12) ; port RAM.RAM31
SD-BA0: U6.20(BA0) ; port RAM.RAM32
SD-BA1: U6.21(BA1) ; port RAM.RAM33
SD-CAS: U6.17(~{CAS}) ; port RAM.RAM34
SD-CKE: U6.37(CKE) ; port RAM.RAM40
SD-CLK: U6.38(CLK) ; port RAM.RAM39
SD-DQ0: U6.2(DQ0) ; port RAM.RAM3
SD-DQ1: U6.4(DQ1) ; port RAM.RAM4
SD-DQ2: U6.5(DQ2) ; port RAM.RAM5
SD-DQ3: U6.7(DQ3) ; port RAM.RAM6
SD-DQ4: U6.8(DQ4) ; port RAM.RAM7
SD-DQ5: U6.10(DQ5) ; port RAM.RAM8
SD-DQ6: U6.11(DQ6) ; port RAM.RAM9
SD-DQ7: U6.13(DQ7) ; port RAM.RAM10
SD-DQ8: U6.42(DQ8) ; port RAM.RAM11
SD-DQ9: U6.44(DQ9) ; port RAM.RAM12
SD-DQ10: U6.45(DQ10) ; port RAM.RAM13
SD-DQ11: U6.47(DQ11) ; port RAM.RAM14
SD-DQ12: U6.48(DQ12) ; port RAM.RAM15
SD-DQ13: U6.50(DQ13) ; port RAM.RAM16
SD-DQ14: U6.51(DQ14) ; port RAM.RAM17
SD-DQ15: U6.53(DQ15) ; port RAM.RAM18
SD-DQMH: U6.39(DQMH) ; port RAM.RAM38
SD-DQML: U6.15(DQML) ; port RAM.RAM37
SD-RAS: U6.18(~{RAS}) ; port RAM.RAM35
SD-WE: U6.16(~{WE}) ; port RAM.RAM36
NetJP7_2: JP7.2 R31.2 U6.19(~{CS})

Not connected (* = marked no-connect by the designer): U6 40(NC)*

### Layout directives
net class RAM: SD-A0, SD-A1, SD-A2, SD-A3, SD-A4, SD-A5, SD-A6, SD-A7, SD-A8, SD-A9, SD-A10, SD-A11, SD-A12, SD-BA0, SD-BA1, SD-CAS, SD-CKE, SD-CLK, SD-DQ0, SD-DQ1, SD-DQ2, SD-DQ3, SD-DQ4, SD-DQ5, SD-DQ6, SD-DQ7, SD-DQ8, SD-DQ9, SD-DQ10, SD-DQ11, SD-DQ12, SD-DQ13, SD-DQ14, SD-DQ15, SD-DQMH, SD-DQML, SD-RAS, SD-WE

### Notes on the sheet
- SDRAM
- A solder jumper was added to use the fpga pin elsewhere
  - The CS is enabled by default
  - Use the solder jumper to disable the SDRAM to reduce power if not used.
- Title
- Revision:
- Sheet
- of
- Date:
- Engineer:

### Library data of the parts
C14 C17 C18 C20 C25 = C0603 - CL10F104ZA8NNNC: as C5 on sheet PERIPHERAL_PORT_IO; Supplier 1: Digi-Key; Manufacturer Part Number: CL10F104ZA8NNNC; RoHS: RoHS Compliant; Category: Capacitors; Stock 1: 400907; Pricing 1: 1=0.1, 10=0.017, 25=0.012, 50=0.009, 100=0.0076, 250=0.00624, 500=0.00536, 1000=0.00417 (USD); Package / Case: 0603 (1608 Metric); Packaging: Cut Tape (CT); ComponentLink1URL: http://www.samsungsem.com/servlet/FileDownload?type=spec&file=CL10F104ZA8NNNC.pdf; ComponentLink1Description: http://www.samsungsem.com/servlet/FileDownload?type=spec&file=CL10F104ZA8NNNC.pdf; Supplier Part Number 1: 1276-1011-1-ND; Value: .1uF; Voltage - Rated: 25V; Mounting Type: Surface Mount, MLCC; Operating Temperature: -30°C ~ 85°C; Applications: General Purpose; Ratings: -; Size / Dimension: 0.063" L x 0.031" W (1.60mm x 0.80mm); Height - Seated (Max): -; Thickness (Max): 0.035" (0.90mm); Lead Spacing: -; Features: -; Lead Style: -; Accept Compatible Replacement Part: Yes
JP7 = Solder Jumper: Solder/Configuration Jumper; Manufacturer: n/a; Manufacturer Part Number: n/a; Source: n/a; Source Part Number: n/a; ROHS Certificate: n/a
R31 = R0603 - CRCW060310K0FKEA: as R1 on sheet PERIPHERAL_PORT_IO; Manufacturer Part Number: CRCW060310K0FKEA; Value: 10k; Supplier 1: Digi-Key; RoHS: RoHS Compliant; Category: Resistors; Stock 1: 997856; Pricing 1: 10=0.081, 50=0.0436, 200=0.0251, 1000=0.01711 (USD); Resistance (Ohms): 10K; Composition: Thick Film; Features: -; Tolerance: ±1%; Size / Dimension: 0.061" L x 0.033" W (1.55mm x 0.85mm); Height: 0.020" (0.50mm); Packaging: Cut Tape (CT); Package / Case: 0603 (1608 Metric); ComponentLink1URL: http://www.vishay.com/doc?20035; ComponentLink1Description: http://www.vishay.com/doc?20035; Supplier Part Number 1: 541-10.0KHCT-ND; Number of Terminations: 2
U6 = SDRAM - MT48LC16M16A2P-7E: 256Mb Synchronous High-Speed CMOS DRAM, 16Mb x 16Bit x 4 Banks, 54-Pin TSOP Pb-free, Commercial; Manufacturer: MICRON; Manufacturer Part Number: MT48LC16M16A2P-7E IT:G; ComponentLink1Description: http://avnetexpress.avnet.com/store/em/EMController?langId=-1&storeId=500201&catalogId=500201&term=mt48lc16m16a2p&x=-860&y=-339&searchType=&advAction=&N=0&Ne=100000&action=products; ComponentLink1URL: http://avnetexpress.avnet.com/store/em/EMController?langId=-1&storeId=500201&catalogId=500201&term=mt48lc16m16a2p&x=-860&y=-339&searchType=&advAction=&N=0&Ne=100000&action=products; Supplier 1: Avnet; RoHS: YES; Stock 1: 662; Pricing 1: 1=6.65, 100=4.68, 1000=4.22 (USD); Supplier Part Number 1: MT48LC16M16A2P-7E IT:G

## Nets that join several sheets
1V2: FPGA_POWER_AND_CONFIGURATION (10 pins), POWER_SUPPLY (C3.1 U2.3)
3V3: DIGITAL_IO (8 pins), FPGA_POWER_AND_CONFIGURATION (47 pins), LOGIC_FPGA (C19.1 U5.1 U5.4), PERIPHERAL_PORT_IO (15 pins), POWER_SUPPLY (6 pins), RAM (13 pins)
+5v_BB: PERIPHERAL_PORT_IO (P9.7 P9.8), POWER_SUPPLY (D1.2 JP8.1)
GND: DIGITAL_IO (15 pins), FPGA_POWER_AND_CONFIGURATION (48 pins), LOGIC_FPGA (C19.2 U5.2), PERIPHERAL_PORT_IO (25 pins), POWER_SUPPLY (11 pins), RAM (13 pins)
ARD_D0: LOGIC_FPGA (U4.84), PERIPHERAL_PORT_IO (PA-3.C1)
ARD_D2: LOGIC_FPGA (U4.21), PERIPHERAL_PORT_IO (PA-3.C3)
ARD_MOSI/CFG_INITB: FPGA_POWER_AND_CONFIGURATION (R26.1 U4.39), PERIPHERAL_PORT_IO (PA-3.C6 U3.4)
ARD_RX/CFG_MODE1: FPGA_POWER_AND_CONFIGURATION (JP3.1 R15.2 U4.60), PERIPHERAL_PORT_IO (PA-3.C7 U3.3)
ARD_SCL: LOGIC_FPGA (U4.80), PERIPHERAL_PORT_IO (JP10.2 PA-4.D10)
ARD_SDA: LOGIC_FPGA (U4.79), PERIPHERAL_PORT_IO (JP11.2 PA-4.D9)
ARD_TX/CFG_MODE0: FPGA_POWER_AND_CONFIGURATION (JP4.1 R14.2 U4.69), PERIPHERAL_PORT_IO (PA-3.C8 U3.2)
BB_SPI_MISO: LOGIC_FPGA (U4.82), PERIPHERAL_PORT_IO (P9.29 PA-4.D5)
BB_SPI_MOSI/CFG_DIN: FPGA_POWER_AND_CONFIGURATION (U4.65 U8.2), PERIPHERAL_PORT_IO (P9.30 PA-4.D4)
BB_SPI_SCK/CFG_CCLK: FPGA_POWER_AND_CONFIGURATION (U4.70 U8.6), PERIPHERAL_PORT_IO (P9.31 PA-4.D6)
BB_SPI_SS: LOGIC_FPGA (U4.81), PERIPHERAL_PORT_IO (P9.28 PA-4.D3)
CFG_DONE: FPGA_POWER_AND_CONFIGURATION (R13.1 U4.71), PERIPHERAL_PORT_IO (U3.5)
CFG_FLSH_RST: FPGA_POWER_AND_CONFIGURATION (JP6.2 R29.1 U8.7), PERIPHERAL_PORT_IO (U3.10)
FLSH_CS_ARD: FPGA_POWER_AND_CONFIGURATION (R30.1 U4.38 U8.1), PERIPHERAL_PORT_IO (PA-3.C4)
FLSH_MOSI_ARD: FPGA_POWER_AND_CONFIGURATION (U4.64 U8.5), PERIPHERAL_PORT_IO (PA-3.C5)
FPGA_RST/CFG_PROGB: DIGITAL_IO (JP5.2), FPGA_POWER_AND_CONFIGURATION (P2.1 R27.1 U4.37), PERIPHERAL_PORT_IO (U3.8)
GPMC_AD0: LOGIC_FPGA (U4.97), PERIPHERAL_PORT_IO (P8.25)
GPMC_AD1: LOGIC_FPGA (U4.98), PERIPHERAL_PORT_IO (P8.24)
GPMC_AD2: LOGIC_FPGA (U4.121), PERIPHERAL_PORT_IO (P8.5)
GPMC_AD3: LOGIC_FPGA (U4.120), PERIPHERAL_PORT_IO (P8.6)
GPMC_AD4: LOGIC_FPGA (U4.99), PERIPHERAL_PORT_IO (P8.23)
GPMC_AD5: LOGIC_FPGA (U4.100), PERIPHERAL_PORT_IO (P8.22)
GPMC_AD6: LOGIC_FPGA (U4.124), PERIPHERAL_PORT_IO (P8.3)
GPMC_AD7: LOGIC_FPGA (U4.123), PERIPHERAL_PORT_IO (P8.4)
GPMC_AD8: LOGIC_FPGA (U4.102), PERIPHERAL_PORT_IO (P8.19)
GPMC_AD9: LOGIC_FPGA (U4.105), PERIPHERAL_PORT_IO (P8.13)
GPMC_AD10: LOGIC_FPGA (U4.104), PERIPHERAL_PORT_IO (P8.14)
GPMC_AD11: LOGIC_FPGA (U4.94), PERIPHERAL_PORT_IO (P8.17)
GPMC_AD12: LOGIC_FPGA (U4.114), PERIPHERAL_PORT_IO (P8.12)
GPMC_AD13: LOGIC_FPGA (U4.115), PERIPHERAL_PORT_IO (P8.11)
GPMC_AD14: LOGIC_FPGA (U4.93), PERIPHERAL_PORT_IO (P8.16)
GPMC_AD15: LOGIC_FPGA (U4.92), PERIPHERAL_PORT_IO (P8.15)
GPMC_ADVN: LOGIC_FPGA (U4.119), PERIPHERAL_PORT_IO (P8.7)
GPMC_BE0N: LOGIC_FPGA (U4.117), PERIPHERAL_PORT_IO (P8.9)
GPMC_BE1N: LOGIC_FPGA (U4.88), PERIPHERAL_PORT_IO (P9.12)
GPMC_CLK: LOGIC_FPGA (U4.95), PERIPHERAL_PORT_IO (P8.18)
GPMC_CSN1: LOGIC_FPGA (U4.101), PERIPHERAL_PORT_IO (P8.21)
GPMC_OEN: LOGIC_FPGA (U4.118), PERIPHERAL_PORT_IO (P8.8)
GPMC_WE1N: LOGIC_FPGA (U4.116), PERIPHERAL_PORT_IO (P8.10)
LED0: DIGITAL_IO (R17.2), LOGIC_FPGA (U4.140), PERIPHERAL_PORT_IO (JP12.1)
LED1: DIGITAL_IO (R16.2), FPGA_POWER_AND_CONFIGURATION (U4.74), PERIPHERAL_PORT_IO (JP9.1)
NetD3_1: PERIPHERAL_PORT_IO (PA-1.A5), POWER_SUPPLY (D3.1)
NetPA-3_C2: LOGIC_FPGA (U4.87), PERIPHERAL_PORT_IO (PA-3.C2)
PB0: DIGITAL_IO (C40.1 PB1.B R23.2), LOGIC_FPGA (U4.83)
PB1: DIGITAL_IO (C41.1 JP5.1 PB0.B R24.2), LOGIC_FPGA (U4.59)
PMOD1_1_2_LVDS8_N: DIGITAL_IO (J2.2), LOGIC_FPGA (U4.111)
PMOD1_1_2_LVDS8_P: DIGITAL_IO (J2.1), LOGIC_FPGA (U4.112)
PMOD1_3_4_LVDS7_N: DIGITAL_IO (J2.4), LOGIC_FPGA (U4.66)
PMOD1_3_4_LVDS7_P: DIGITAL_IO (J2.3), LOGIC_FPGA (U4.67)
PMOD1_7_8_LVDS1_A_N: DIGITAL_IO (J2.8), LOGIC_FPGA (U4.61)
PMOD1_7_8_LVDS1_A_P: DIGITAL_IO (J2.7), LOGIC_FPGA (U4.62)
PMOD1_9_10_LVDS2_B_N: DIGITAL_IO (J2.10), LOGIC_FPGA (U4.57)
PMOD1_9_10_LVDS2_B_P: DIGITAL_IO (J2.9), LOGIC_FPGA (U4.58)
PMOD2_1_2_LVDS6_N: DIGITAL_IO (J4.2), LOGIC_FPGA (U4.55)
PMOD2_1_2_LVDS6_P: DIGITAL_IO (J4.1), LOGIC_FPGA (U4.56)
PMOD2_3_4_LVDS5_N: DIGITAL_IO (J4.4), LOGIC_FPGA (U4.45)
PMOD2_3_4_LVDS5_P: DIGITAL_IO (J4.3), LOGIC_FPGA (U4.46)
PMOD2_7_8_LVDS3_A_N: DIGITAL_IO (J4.8), LOGIC_FPGA (U4.47)
PMOD2_7_8_LVDS3_A_P: DIGITAL_IO (J4.7), LOGIC_FPGA (U4.48)
PMOD2_9_10_LVDS4_B_N: DIGITAL_IO (J4.10), LOGIC_FPGA (U4.43)
PMOD2_9_10_LVDS4_B_P: DIGITAL_IO (J4.9), LOGIC_FPGA (U4.44)
SATA_D1_N: DIGITAL_IO (P4.3), LOGIC_FPGA (U4.40)
SATA_D1_P: DIGITAL_IO (P4.2), LOGIC_FPGA (U4.41)
SATA_D2_N: DIGITAL_IO (P4.5), LOGIC_FPGA (U4.50)
SATA_D2_P: DIGITAL_IO (P4.6), LOGIC_FPGA (U4.51)
SD-A0: LOGIC_FPGA (U4.5), RAM (U6.23)
SD-A1: LOGIC_FPGA (U4.6), RAM (U6.24)
SD-A2: LOGIC_FPGA (U4.7), RAM (U6.25)
SD-A3: LOGIC_FPGA (U4.8), RAM (U6.26)
SD-A4: LOGIC_FPGA (U4.35), RAM (U6.29)
SD-A5: LOGIC_FPGA (U4.34), RAM (U6.30)
SD-A6: LOGIC_FPGA (U4.33), RAM (U6.31)
SD-A7: LOGIC_FPGA (U4.32), RAM (U6.32)
SD-A8: LOGIC_FPGA (U4.30), RAM (U6.33)
SD-A9: LOGIC_FPGA (U4.29), RAM (U6.34)
SD-A10: LOGIC_FPGA (U4.2), RAM (U6.22)
SD-A11: LOGIC_FPGA (U4.27), RAM (U6.35)
SD-A12: LOGIC_FPGA (U4.26), RAM (U6.36)
SD-BA0: LOGIC_FPGA (U4.141), RAM (U6.20)
SD-BA1: LOGIC_FPGA (U4.1), RAM (U6.21)
SD-CAS: LOGIC_FPGA (U4.143), RAM (U6.17)
SD-CKE: LOGIC_FPGA (U4.24), RAM (U6.37)
SD-CLK: LOGIC_FPGA (U4.23), RAM (U6.38)
SD-DQ0: LOGIC_FPGA (U4.126), RAM (U6.2)
SD-DQ1: LOGIC_FPGA (U4.127), RAM (U6.4)
SD-DQ2: LOGIC_FPGA (U4.131), RAM (U6.5)
SD-DQ3: LOGIC_FPGA (U4.132), RAM (U6.7)
SD-DQ4: LOGIC_FPGA (U4.133), RAM (U6.8)
SD-DQ5: LOGIC_FPGA (U4.134), RAM (U6.10)
SD-DQ6: LOGIC_FPGA (U4.137), RAM (U6.11)
SD-DQ7: LOGIC_FPGA (U4.138), RAM (U6.13)
SD-DQ8: LOGIC_FPGA (U4.17), RAM (U6.42)
SD-DQ9: LOGIC_FPGA (U4.16), RAM (U6.44)
SD-DQ10: LOGIC_FPGA (U4.15), RAM (U6.45)
SD-DQ11: LOGIC_FPGA (U4.14), RAM (U6.47)
SD-DQ12: LOGIC_FPGA (U4.12), RAM (U6.48)
SD-DQ13: LOGIC_FPGA (U4.11), RAM (U6.50)
SD-DQ14: LOGIC_FPGA (U4.10), RAM (U6.51)
SD-DQ15: LOGIC_FPGA (U4.9), RAM (U6.53)
SD-DQMH: LOGIC_FPGA (U4.22), RAM (U6.39)
SD-DQML: LOGIC_FPGA (U4.139), RAM (U6.15)
SD-RAS: LOGIC_FPGA (U4.142), RAM (U6.18)
SD-WE: LOGIC_FPGA (U4.144), RAM (U6.16)
SW0: DIGITAL_IO (R28.2 SW2.A2), LOGIC_FPGA (U4.75)
SW1: DIGITAL_IO (R25.2 SW2.A1), LOGIC_FPGA (U4.78)

## Assembly variants
Complete: not fitted C40 C41
Final MFG: not fitted C40 C41 J3